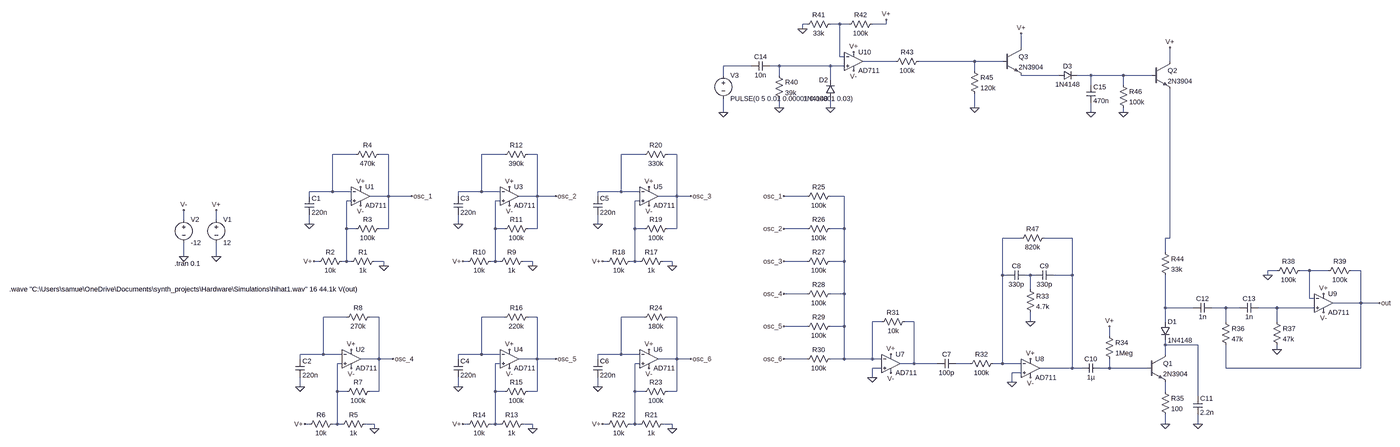
[diagram p0: schematic schmitt_trigger_hihat.asc, whole sheet]
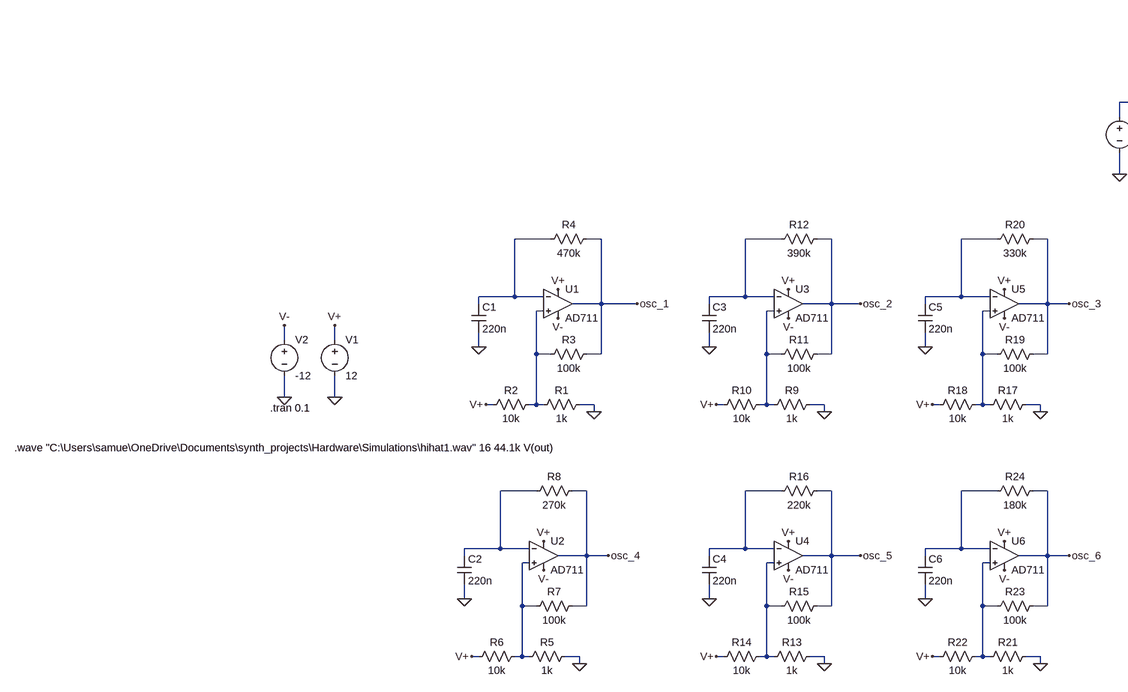
[diagram p1: schematic schmitt_trigger_hihat.asc, part, row 1 of 1, column 1 of 2]
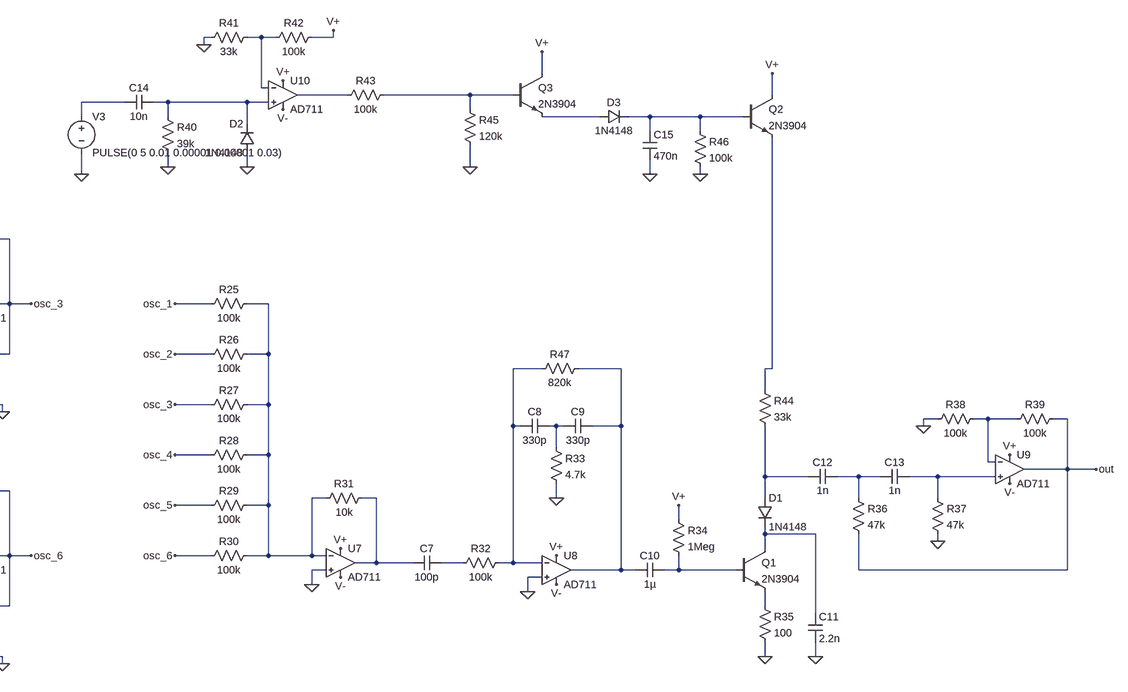
[diagram p2: schematic schmitt_trigger_hihat.asc, part, row 1 of 1, column 2 of 2]
schmitt_trigger_hihat.asc, the LTspice schematic file:
Version 4
SHEET 1 4008 892
WIRE 1984 -544 1968 -544
WIRE 2096 -544 2064 -544
WIRE 2128 -544 2096 -544
WIRE 2256 -544 2256 -560
WIRE 2256 -544 2208 -544
WIRE 1968 -528 1968 -544
WIRE 2720 -464 2720 -512
WIRE 2096 -432 2096 -544
WIRE 2112 -432 2096 -432
WIRE 2288 -416 2176 -416
WIRE 2560 -416 2368 -416
WIRE 2656 -416 2560 -416
WIRE 3232 -416 3232 -464
WIRE 1792 -400 1696 -400
WIRE 1888 -400 1856 -400
WIRE 2064 -400 1888 -400
WIRE 2112 -400 2064 -400
WIRE 2560 -384 2560 -416
WIRE 1696 -368 1696 -400
WIRE 1888 -368 1888 -400
WIRE 2848 -368 2720 -368
WIRE 2960 -368 2912 -368
WIRE 3072 -368 2960 -368
WIRE 3168 -368 3072 -368
WIRE 2064 -352 2064 -400
WIRE 2960 -336 2960 -368
WIRE 3072 -336 3072 -368
WIRE 1888 -256 1888 -288
WIRE 2064 -256 2064 -288
WIRE 2560 -256 2560 -304
WIRE 1696 -240 1696 -288
WIRE 2960 -240 2960 -272
WIRE 3072 -240 3072 -256
WIRE 432 -96 352 -96
WIRE 544 -96 512 -96
WIRE 944 -96 864 -96
WIRE 1056 -96 1024 -96
WIRE 1424 -96 1344 -96
WIRE 1536 -96 1504 -96
WIRE 352 32 352 -96
WIRE 352 32 272 32
WIRE 416 32 352 32
WIRE 864 32 864 -96
WIRE 864 32 784 32
WIRE 928 32 864 32
WIRE 1344 32 1344 -96
WIRE 1344 32 1264 32
WIRE 1408 32 1344 32
WIRE 272 48 272 32
WIRE 544 48 544 -96
WIRE 544 48 480 48
WIRE 624 48 544 48
WIRE 784 48 784 32
WIRE 1056 48 1056 -96
WIRE 1056 48 992 48
WIRE 1120 48 1056 48
WIRE 1264 48 1264 32
WIRE 1536 48 1536 -96
WIRE 1536 48 1472 48
WIRE 1584 48 1536 48
WIRE 1984 48 1904 48
WIRE 2112 48 2064 48
WIRE 416 64 400 64
WIRE 928 64 912 64
WIRE 1408 64 1392 64
WIRE -160 128 -160 96
WIRE -48 128 -48 96
WIRE 272 144 272 112
WIRE 784 144 784 112
WIRE 1264 144 1264 112
WIRE 400 160 400 64
WIRE 432 160 400 160
WIRE 544 160 544 48
WIRE 544 160 512 160
WIRE 912 160 912 64
WIRE 944 160 912 160
WIRE 1056 160 1056 48
WIRE 1056 160 1024 160
WIRE 1392 160 1392 64
WIRE 1424 160 1392 160
WIRE 1536 160 1536 48
WIRE 1536 160 1504 160
WIRE 1984 160 1904 160
WIRE 2112 160 2112 48
WIRE 2112 160 2064 160
WIRE 2720 192 2656 192
WIRE 2896 192 2800 192
WIRE 3232 192 3232 -320
WIRE 3232 192 3216 192
WIRE 3216 240 3216 192
WIRE -160 256 -160 208
WIRE -48 256 -48 208
WIRE 304 272 288 272
WIRE 400 272 400 160
WIRE 400 272 384 272
WIRE 416 272 400 272
WIRE 528 272 496 272
WIRE 816 272 800 272
WIRE 912 272 912 160
WIRE 912 272 896 272
WIRE 928 272 912 272
WIRE 1040 272 1008 272
WIRE 1296 272 1280 272
WIRE 1392 272 1392 160
WIRE 1392 272 1376 272
WIRE 1408 272 1392 272
WIRE 1520 272 1488 272
WIRE 1984 272 1904 272
WIRE 2112 272 2112 160
WIRE 2112 272 2064 272
WIRE 528 288 528 272
WIRE 1040 288 1040 272
WIRE 1520 288 1520 272
WIRE 3600 304 3568 304
WIRE 3712 304 3680 304
WIRE 3776 304 3712 304
WIRE 3888 304 3856 304
WIRE 2656 320 2656 192
WIRE 2672 320 2656 320
WIRE 2752 320 2736 320
WIRE 2768 320 2752 320
WIRE 2896 320 2896 192
WIRE 2896 320 2832 320
WIRE 3568 320 3568 304
WIRE 2752 368 2752 320
WIRE 1984 384 1904 384
WIRE 2112 384 2112 272
WIRE 2112 384 2064 384
WIRE 3712 400 3712 304
WIRE 3728 400 3712 400
WIRE 3888 416 3888 304
WIRE 3888 416 3792 416
WIRE 3952 416 3888 416
WIRE 3216 432 3216 320
WIRE 3312 432 3216 432
WIRE 3424 432 3376 432
WIRE 3472 432 3424 432
WIRE 3600 432 3536 432
WIRE 3728 432 3600 432
WIRE 400 464 320 464
WIRE 512 464 480 464
WIRE 944 464 864 464
WIRE 1056 464 1024 464
WIRE 1424 464 1344 464
WIRE 1536 464 1504 464
WIRE 2240 480 2208 480
WIRE 2352 480 2320 480
WIRE 2752 480 2752 448
WIRE 3216 480 3216 432
WIRE 3424 480 3424 432
WIRE 3600 480 3600 432
WIRE 1984 496 1904 496
WIRE 2112 496 2112 384
WIRE 2112 496 2064 496
WIRE 3024 528 3024 496
WIRE 3216 560 3216 544
WIRE 3328 560 3216 560
WIRE 3600 576 3600 560
WIRE 320 592 320 464
WIRE 320 592 240 592
WIRE 384 592 320 592
WIRE 864 592 864 464
WIRE 864 592 784 592
WIRE 928 592 864 592
WIRE 1344 592 1344 464
WIRE 1344 592 1264 592
WIRE 1408 592 1344 592
WIRE 3216 592 3216 560
WIRE 240 608 240 592
WIRE 512 608 512 464
WIRE 512 608 448 608
WIRE 560 608 512 608
WIRE 784 608 784 592
WIRE 1056 608 1056 464
WIRE 1056 608 992 608
WIRE 1120 608 1056 608
WIRE 1264 608 1264 592
WIRE 1536 608 1536 464
WIRE 1536 608 1472 608
WIRE 1584 608 1536 608
WIRE 1984 608 1904 608
WIRE 2112 608 2112 496
WIRE 2112 608 2064 608
WIRE 2208 608 2208 480
WIRE 2208 608 2112 608
WIRE 2240 608 2208 608
WIRE 384 624 368 624
WIRE 928 624 912 624
WIRE 1408 624 1392 624
WIRE 2352 624 2352 480
WIRE 2352 624 2304 624
WIRE 2432 624 2352 624
WIRE 2544 624 2496 624
WIRE 2656 624 2656 320
WIRE 2656 624 2624 624
WIRE 2720 624 2656 624
WIRE 2240 640 2208 640
WIRE 2896 640 2896 320
WIRE 2896 640 2784 640
WIRE 2928 640 2896 640
WIRE 3024 640 3024 608
WIRE 3024 640 2992 640
WIRE 3152 640 3024 640
WIRE 3424 640 3424 560
WIRE 3888 640 3888 416
WIRE 3888 640 3424 640
WIRE 2720 656 2688 656
WIRE 2208 672 2208 640
WIRE 2688 688 2688 656
WIRE 240 704 240 672
WIRE 784 704 784 672
WIRE 1264 704 1264 672
WIRE 368 720 368 624
WIRE 400 720 368 720
WIRE 512 720 512 608
WIRE 512 720 480 720
WIRE 912 720 912 624
WIRE 944 720 912 720
WIRE 1056 720 1056 608
WIRE 1056 720 1024 720
WIRE 1392 720 1392 624
WIRE 1424 720 1392 720
WIRE 1536 720 1536 608
WIRE 1536 720 1504 720
WIRE 3216 720 3216 688
WIRE 3328 736 3328 560
WIRE 272 832 256 832
WIRE 368 832 368 720
WIRE 368 832 352 832
WIRE 384 832 368 832
WIRE 496 832 464 832
WIRE 816 832 800 832
WIRE 912 832 912 720
WIRE 912 832 896 832
WIRE 928 832 912 832
WIRE 1040 832 1008 832
WIRE 1296 832 1280 832
WIRE 1392 832 1392 720
WIRE 1392 832 1376 832
WIRE 1408 832 1392 832
WIRE 1520 832 1488 832
WIRE 3216 832 3216 800
WIRE 3328 832 3328 800
WIRE 496 848 496 832
WIRE 1040 848 1040 832
WIRE 1520 848 1520 832
FLAG -48 256 0
FLAG -48 96 V+
FLAG -160 256 0
FLAG -160 96 V-
FLAG 448 16 V+
FLAG 448 80 V-
FLAG 272 144 0
FLAG 528 288 0
FLAG 288 272 V+
FLAG 416 576 V+
FLAG 416 640 V-
FLAG 240 704 0
FLAG 496 848 0
FLAG 256 832 V+
FLAG 960 16 V+
FLAG 960 80 V-
FLAG 784 144 0
FLAG 1040 288 0
FLAG 800 272 V+
FLAG 960 576 V+
FLAG 960 640 V-
FLAG 784 704 0
FLAG 1040 848 0
FLAG 800 832 V+
FLAG 1440 16 V+
FLAG 1440 80 V-
FLAG 1264 144 0
FLAG 1520 288 0
FLAG 1280 272 V+
FLAG 1440 576 V+
FLAG 1440 640 V-
FLAG 1264 704 0
FLAG 1520 848 0
FLAG 1280 832 V+
FLAG 624 48 osc_1
FLAG 1120 48 osc_2
FLAG 1584 48 osc_3
FLAG 1584 608 osc_6
FLAG 1120 608 osc_5
FLAG 560 608 osc_4
FLAG 1904 48 osc_1
FLAG 1904 160 osc_2
FLAG 1904 272 osc_3
FLAG 1904 384 osc_4
FLAG 1904 496 osc_5
FLAG 1904 608 osc_6
FLAG 2272 592 V+
FLAG 2272 656 V-
FLAG 2208 672 0
FLAG 2752 608 V+
FLAG 2752 672 V-
FLAG 2688 688 0
FLAG 2752 480 0
FLAG 3024 496 V+
FLAG 3216 832 0
FLAG 3328 832 0
FLAG 3600 576 0
FLAG 3760 384 V+
FLAG 3760 448 V-
FLAG 3568 320 0
FLAG 1888 -256 0
FLAG 2064 -256 0
FLAG 2144 -448 V+
FLAG 2144 -384 V-
FLAG 1968 -528 0
FLAG 2256 -560 V+
FLAG 2560 -256 0
FLAG 2720 -512 V+
FLAG 2960 -240 0
FLAG 3072 -240 0
FLAG 3232 -464 V+
FLAG 1696 -240 0
FLAG 3952 416 out
SYMBOL voltage -48 112 R0
WINDOW 123 0 0 Left 0
WINDOW 39 0 0 Left 0
SYMATTR InstName V1
SYMATTR Value 12
SYMBOL voltage -160 112 R0
WINDOW 123 0 0 Left 0
WINDOW 39 0 0 Left 0
SYMATTR InstName V2
SYMATTR Value -12
SYMBOL OpAmps\\AD711 448 -16 R0
SYMATTR InstName U1
SYMBOL res 512 256 R90
WINDOW 0 0 56 VBottom 2
WINDOW 3 32 56 VTop 2
SYMATTR InstName R1
SYMATTR Value 1k
SYMBOL res 400 256 R90
WINDOW 0 0 56 VBottom 2
WINDOW 3 32 56 VTop 2
SYMATTR InstName R2
SYMATTR Value 10k
SYMBOL res 528 144 R90
WINDOW 0 0 56 VBottom 2
WINDOW 3 32 56 VTop 2
SYMATTR InstName R3
SYMATTR Value 100k
SYMBOL res 528 -112 R90
WINDOW 0 0 56 VBottom 2
WINDOW 3 32 56 VTop 2
SYMATTR InstName R4
SYMATTR Value 470k
SYMBOL cap 256 48 R0
SYMATTR InstName C1
SYMATTR Value 220n
SYMBOL OpAmps\\AD711 416 544 R0
SYMATTR InstName U2
SYMBOL res 480 816 R90
WINDOW 0 0 56 VBottom 2
WINDOW 3 32 56 VTop 2
SYMATTR InstName R5
SYMATTR Value 1k
SYMBOL res 368 816 R90
WINDOW 0 0 56 VBottom 2
WINDOW 3 32 56 VTop 2
SYMATTR InstName R6
SYMATTR Value 10k
SYMBOL res 496 704 R90
WINDOW 0 0 56 VBottom 2
WINDOW 3 32 56 VTop 2
SYMATTR InstName R7
SYMATTR Value 100k
SYMBOL res 496 448 R90
WINDOW 0 0 56 VBottom 2
WINDOW 3 32 56 VTop 2
SYMATTR InstName R8
SYMATTR Value 270k
SYMBOL cap 224 608 R0
SYMATTR InstName C2
SYMATTR Value 220n
SYMBOL OpAmps\\AD711 960 -16 R0
SYMATTR InstName U3
SYMBOL res 1024 256 R90
WINDOW 0 0 56 VBottom 2
WINDOW 3 32 56 VTop 2
SYMATTR InstName R9
SYMATTR Value 1k
SYMBOL res 912 256 R90
WINDOW 0 0 56 VBottom 2
WINDOW 3 32 56 VTop 2
SYMATTR InstName R10
SYMATTR Value 10k
SYMBOL res 1040 144 R90
WINDOW 0 0 56 VBottom 2
WINDOW 3 32 56 VTop 2
SYMATTR InstName R11
SYMATTR Value 100k
SYMBOL res 1040 -112 R90
WINDOW 0 0 56 VBottom 2
WINDOW 3 32 56 VTop 2
SYMATTR InstName R12
SYMATTR Value 390k
SYMBOL cap 768 48 R0
SYMATTR InstName C3
SYMATTR Value 220n
SYMBOL OpAmps\\AD711 960 544 R0
SYMATTR InstName U4
SYMBOL res 1024 816 R90
WINDOW 0 0 56 VBottom 2
WINDOW 3 32 56 VTop 2
SYMATTR InstName R13
SYMATTR Value 1k
SYMBOL res 912 816 R90
WINDOW 0 0 56 VBottom 2
WINDOW 3 32 56 VTop 2
SYMATTR InstName R14
SYMATTR Value 10k
SYMBOL res 1040 704 R90
WINDOW 0 0 56 VBottom 2
WINDOW 3 32 56 VTop 2
SYMATTR InstName R15
SYMATTR Value 100k
SYMBOL res 1040 448 R90
WINDOW 0 0 56 VBottom 2
WINDOW 3 32 56 VTop 2
SYMATTR InstName R16
SYMATTR Value 220k
SYMBOL cap 768 608 R0
SYMATTR InstName C4
SYMATTR Value 220n
SYMBOL OpAmps\\AD711 1440 -16 R0
SYMATTR InstName U5
SYMBOL res 1504 256 R90
WINDOW 0 0 56 VBottom 2
WINDOW 3 32 56 VTop 2
SYMATTR InstName R17
SYMATTR Value 1k
SYMBOL res 1392 256 R90
WINDOW 0 0 56 VBottom 2
WINDOW 3 32 56 VTop 2
SYMATTR InstName R18
SYMATTR Value 10k
SYMBOL res 1520 144 R90
WINDOW 0 0 56 VBottom 2
WINDOW 3 32 56 VTop 2
SYMATTR InstName R19
SYMATTR Value 100k
SYMBOL res 1520 -112 R90
WINDOW 0 0 56 VBottom 2
WINDOW 3 32 56 VTop 2
SYMATTR InstName R20
SYMATTR Value 330k
SYMBOL cap 1248 48 R0
SYMATTR InstName C5
SYMATTR Value 220n
SYMBOL OpAmps\\AD711 1440 544 R0
SYMATTR InstName U6
SYMBOL res 1504 816 R90
WINDOW 0 0 56 VBottom 2
WINDOW 3 32 56 VTop 2
SYMATTR InstName R21
SYMATTR Value 1k
SYMBOL res 1392 816 R90
WINDOW 0 0 56 VBottom 2
WINDOW 3 32 56 VTop 2
SYMATTR InstName R22
SYMATTR Value 10k
SYMBOL res 1520 704 R90
WINDOW 0 0 56 VBottom 2
WINDOW 3 32 56 VTop 2
SYMATTR InstName R23
SYMATTR Value 100k
SYMBOL res 1520 448 R90
WINDOW 0 0 56 VBottom 2
WINDOW 3 32 56 VTop 2
SYMATTR InstName R24
SYMATTR Value 180k
SYMBOL cap 1248 608 R0
SYMATTR InstName C6
SYMATTR Value 220n
SYMBOL res 2080 32 R90
WINDOW 0 0 56 VBottom 2
WINDOW 3 32 56 VTop 2
SYMATTR InstName R25
SYMATTR Value 100k
SYMBOL res 2080 144 R90
WINDOW 0 0 56 VBottom 2
WINDOW 3 32 56 VTop 2
SYMATTR InstName R26
SYMATTR Value 100k
SYMBOL res 2080 256 R90
WINDOW 0 0 56 VBottom 2
WINDOW 3 32 56 VTop 2
SYMATTR InstName R27
SYMATTR Value 100k
SYMBOL res 2080 368 R90
WINDOW 0 0 56 VBottom 2
WINDOW 3 32 56 VTop 2
SYMATTR InstName R28
SYMATTR Value 100k
SYMBOL res 2080 480 R90
WINDOW 0 0 56 VBottom 2
WINDOW 3 32 56 VTop 2
SYMATTR InstName R29
SYMATTR Value 100k
SYMBOL res 2080 592 R90
WINDOW 0 0 56 VBottom 2
WINDOW 3 32 56 VTop 2
SYMATTR InstName R30
SYMATTR Value 100k
SYMBOL OpAmps\\AD711 2272 560 R0
SYMATTR InstName U7
SYMBOL res 2336 464 R90
WINDOW 0 0 56 VBottom 2
WINDOW 3 32 56 VTop 2
SYMATTR InstName R31
SYMATTR Value 10k
SYMBOL cap 2496 608 R90
WINDOW 0 0 32 VBottom 2
WINDOW 3 32 32 VTop 2
SYMATTR InstName C7
SYMATTR Value 100p
SYMBOL res 2640 608 R90
WINDOW 0 0 56 VBottom 2
WINDOW 3 32 56 VTop 2
SYMATTR InstName R32
SYMATTR Value 100k
SYMBOL OpAmps\\AD711 2752 576 R0
SYMATTR InstName U8
SYMBOL cap 2736 304 R90
WINDOW 0 0 32 VBottom 2
WINDOW 3 32 32 VTop 2
SYMATTR InstName C8
SYMATTR Value 330p
SYMBOL cap 2832 304 R90
WINDOW 0 0 32 VBottom 2
WINDOW 3 32 32 VTop 2
SYMATTR InstName C9
SYMATTR Value 330p
SYMBOL res 2736 352 R0
SYMATTR InstName R33
SYMATTR Value 4.7k
SYMBOL cap 2992 624 R90
WINDOW 0 0 32 VBottom 2
WINDOW 3 32 32 VTop 2
SYMATTR InstName C10
SYMATTR Value 1µ
SYMBOL res 3008 512 R0
SYMATTR InstName R34
SYMATTR Value 1Meg
SYMBOL npn 3152 592 R0
SYMATTR InstName Q1
SYMATTR Value 2N3904
SYMBOL res 3200 704 R0
SYMATTR InstName R35
SYMATTR Value 100
SYMBOL diode 3200 480 R0
SYMATTR InstName D1
SYMATTR Value 1N4148
SYMBOL cap 3312 736 R0
SYMATTR InstName C11
SYMATTR Value 2.2n
SYMBOL cap 3376 416 R90
WINDOW 0 0 32 VBottom 2
WINDOW 3 32 32 VTop 2
SYMATTR InstName C12
SYMATTR Value 1n
SYMBOL res 3408 464 R0
SYMATTR InstName R36
SYMATTR Value 47k
SYMBOL cap 3536 416 R90
WINDOW 0 0 32 VBottom 2
WINDOW 3 32 32 VTop 2
SYMATTR InstName C13
SYMATTR Value 1n
SYMBOL res 3584 464 R0
SYMATTR InstName R37
SYMATTR Value 47k
SYMBOL OpAmps\\AD711 3760 352 R0
SYMATTR InstName U9
SYMBOL res 3696 288 R90
WINDOW 0 0 56 VBottom 2
WINDOW 3 32 56 VTop 2
SYMATTR InstName R38
SYMATTR Value 100k
SYMBOL res 3872 288 R90
WINDOW 0 0 56 VBottom 2
WINDOW 3 32 56 VTop 2
SYMATTR InstName R39
SYMATTR Value 100k
SYMBOL cap 1856 -416 R90
WINDOW 0 0 32 VBottom 2
WINDOW 3 32 32 VTop 2
SYMATTR InstName C14
SYMATTR Value 10n
SYMBOL res 1872 -384 R0
SYMATTR InstName R40
SYMATTR Value 39k
SYMBOL diode 2080 -288 R180
WINDOW 0 24 64 Left 2
WINDOW 3 24 0 Left 2
SYMATTR InstName D2
SYMATTR Value 1N4148
SYMBOL OpAmps\\AD711 2144 -480 R0
SYMATTR InstName U10
SYMBOL res 2080 -560 R90
WINDOW 0 0 56 VBottom 2
WINDOW 3 32 56 VTop 2
SYMATTR InstName R41
SYMATTR Value 33k
SYMBOL res 2224 -560 R90
WINDOW 0 0 56 VBottom 2
WINDOW 3 32 56 VTop 2
SYMATTR InstName R42
SYMATTR Value 100k
SYMBOL res 2384 -432 R90
WINDOW 0 0 56 VBottom 2
WINDOW 3 32 56 VTop 2
SYMATTR InstName R43
SYMATTR Value 100k
SYMBOL res 2544 -400 R0
SYMATTR InstName R45
SYMATTR Value 120k
SYMBOL npn 2656 -464 R0
SYMATTR InstName Q3
SYMATTR Value 2N3904
SYMBOL diode 2848 -352 R270
WINDOW 0 32 32 VTop 2
WINDOW 3 0 32 VBottom 2
SYMATTR InstName D3
SYMATTR Value 1N4148
SYMBOL cap 2944 -336 R0
SYMATTR InstName C15
SYMATTR Value 470n
SYMBOL res 3056 -352 R0
SYMATTR InstName R46
SYMATTR Value 100k
SYMBOL npn 3168 -416 R0
SYMATTR InstName Q2
SYMATTR Value 2N3904
SYMBOL res 3200 224 R0
SYMATTR InstName R44
SYMATTR Value 33k
SYMBOL voltage 1696 -384 R0
WINDOW 123 0 0 Left 0
WINDOW 39 0 0 Left 0
SYMATTR InstName V3
SYMATTR Value PULSE(0 5 0.01 0.00001 0.00001 0.03)
SYMBOL res 2816 176 R90
WINDOW 0 0 56 VBottom 2
WINDOW 3 32 56 VTop 2
SYMATTR InstName R47
SYMATTR Value 820k
TEXT -192 280 Left 2 !.tran 0.1
TEXT -760 368 Left 2 !.wave "C:\\Users\\samue\\OneDrive\\Documents\\synth_projects\\Hardware\\Simulations\\hihat1.wav" 16 44.1k V(out)

The netlist it stands for:
* schmitt_trigger_hihat.asc
V1 V+ 0 12
V2 V- 0 -12
XU1 N012 N008 V+ V- osc_1 AD712  ; AD711, pins In+ In- V+ V- OUT
R1 0 N012 1k
R2 N012 V+ 10k
R3 osc_1 N012 100k
R4 osc_1 N008 470k
C1 N008 0 220n
XU2 N028 N023 V+ V- osc_4 AD712  ; AD711, pins In+ In- V+ V- OUT
R5 0 N028 1k
R6 N028 V+ 10k
R7 osc_4 N028 100k
R8 osc_4 N023 270k
C2 N023 0 220n
XU3 N013 N009 V+ V- osc_2 AD712  ; AD711, pins In+ In- V+ V- OUT
R9 0 N013 1k
R10 N013 V+ 10k
R11 osc_2 N013 100k
R12 osc_2 N009 390k
C3 N009 0 220n
XU4 N029 N024 V+ V- osc_5 AD712  ; AD711, pins In+ In- V+ V- OUT
R13 0 N029 1k
R14 N029 V+ 10k
R15 osc_5 N029 100k
R16 osc_5 N024 220k
C4 N024 0 220n
XU5 N014 N010 V+ V- osc_3 AD712  ; AD711, pins In+ In- V+ V- OUT
R17 0 N014 1k
R18 N014 V+ 10k
R19 osc_3 N014 100k
R20 osc_3 N010 330k
C5 N010 0 220n
XU6 N030 N025 V+ V- osc_6 AD712  ; AD711, pins In+ In- V+ V- OUT
R21 0 N030 1k
R22 N030 V+ 10k
R23 osc_6 N030 100k
R24 osc_6 N025 180k
C6 N025 0 220n
R25 N011 osc_1 100k
R26 N011 osc_2 100k
R27 N011 osc_3 100k
R28 N011 osc_4 100k
R29 N011 osc_5 100k
R30 N011 osc_6 100k
XU7 0 N011 V+ V- N026 AD712  ; AD711, pins In+ In- V+ V- OUT
R31 N026 N011 10k
C7 N031 N026 100p
R32 N015 N031 100k
XU8 0 N015 V+ V- N016 AD712  ; AD711, pins In+ In- V+ V- OUT
C8 N019 N015 330p
C9 N016 N019 330p
R33 N019 0 4.7k
C10 N032 N016 1µ
R34 V+ N032 1Meg
Q1 N027 N032 N033 0 2N3904
R35 N033 0 100
D1 N020 N027 1N4148
C11 N027 0 2.2n
C12 N021 N020 1n
R36 N021 out 47k
C13 N022 N021 1n
R37 N022 0 47k
XU9 N022 N018 V+ V- out AD712  ; AD711, pins In+ In- V+ V- OUT
R38 N018 0 100k
R39 out N018 100k
C14 N005 N004 10n
R40 N005 0 39k
D2 0 N005 1N4148
XU10 N005 N001 V+ V- N002 AD712  ; AD711, pins In+ In- V+ V- OUT
R41 N001 0 33k
R42 V+ N001 100k
R43 N003 N002 100k
R45 N003 0 120k
Q3 V+ N003 N006 0 2N3904
D3 N006 N007 1N4148
C15 N007 0 470n
R46 N007 0 100k
Q2 V+ N007 N017 0 2N3904
R44 N017 N020 33k
V3 N004 0 PULSE(0 5 0.01 0.00001 0.00001 0.03)
R47 N016 N015 820k
.model D D
.lib standard.dio
.model NPN NPN
.model PNP PNP
.lib standard.bjt
.tran 0.1
.wave "C:\Users\samue\OneDrive\Documents\synth_projects\Hardware\Simulations\hihat1.wav" 16 44.1k V(out)
.lib ADI1.lib
.backanno
.end